# EAGLE design magicmouth-v1.0 (EAGLE 6.3)
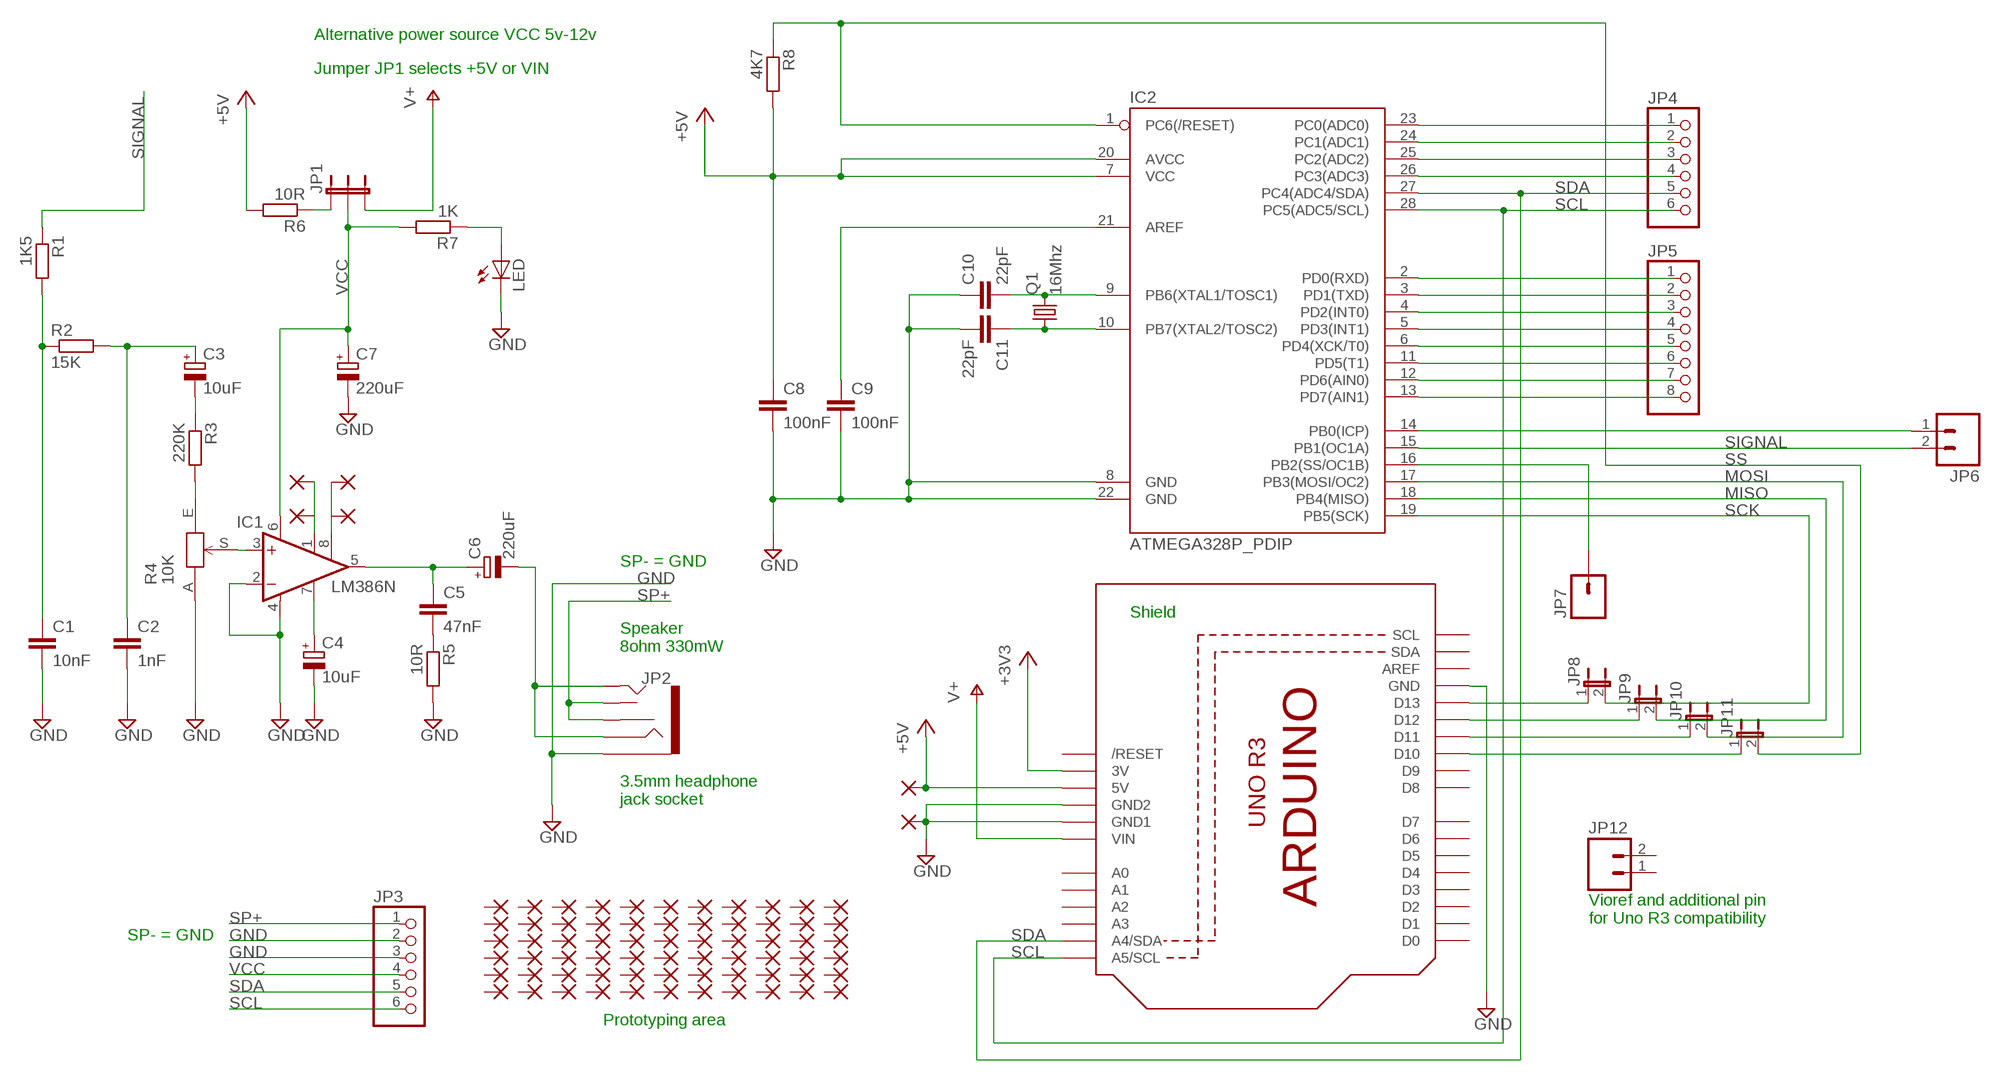
[diagram p0: schematic, sheet 1]

## Parts
C1  10nF  C-EU050-025X075  [C050-025X075]
C2  1nF  C-EU050-025X075  [C050-025X075]
C3  10uF  CPOL-EUE2.5-7  [E2,5-7]
C4  10uF  CPOL-EUE2.5-7  [E2,5-7]
C5  47nF  C-EU050-025X075  [C050-025X075]
C6  220uF  CPOL-EUTT2D7  [TT2D7]
C7  220uF  CPOL-EUTT2D7  [TT2D7]
C8  100nF  C-EU025-025X050  [C025-025X050]
C9  100nF  C-EU025-025X050  [C025-025X050]
C10  22pF  C-EU025-025X050  [C025-025X050]
C11  22pF  C-EU025-025X050  [C025-025X050]
IC1  LM386N  LM386N-1  [DIL08]
IC2  ATMEGA328P_PDIP  [DIL28-3]
JP1  JUMPER-3PTH  [1X03]
JP2  AUDIO-JACK2PTH  [AUDIO-JACK]
JP3  PINHD-1X6CB  [1X06-CLEANBIG]
JP4  PINHD-1X6CB  [1X06-CLEANBIG]
JP5  PINHD-1X8CLEANBIG  [1X08-CLEANBIG]
JP6  M021X02_NO_SILK  [1X02_NO_SILK]
JP7  M01SMDNS  [1X01NS]
JP8  JUMPER-2PTH  [1X02]
JP9  JUMPER-2PTH  [1X02]
JP10  JUMPER-2PTH  [1X02]
JP11  JUMPER-2PTH  [1X02]
JP12  M021X02_NO_SILK  [1X02_NO_SILK]
LED  LED3MM  [LED3MM]
PAD1  1,6/0,8  [1,6/0,8]
PAD2  1,6/0,8  [1,6/0,8]
PAD3  1,6/0,8  [1,6/0,8]
PAD4  1,6/0,8  [1,6/0,8]
PAD7  1,6/0,8  [1,6/0,8]
PAD8  1,6/0,8  [1,6/0,8]
PAD9  1,6/0,8  [1,6/0,8]
PAD10  1,6/0,8  [1,6/0,8]
PAD11  1,6/0,8  [1,6/0,8]
PAD12  1,6/0,8  [1,6/0,8]
PAD13  1,6/0,8  [1,6/0,8]
PAD14  1,6/0,8  [1,6/0,8]
PAD15  1,6/0,8  [1,6/0,8]
PAD16  1,6/0,8  [1,6/0,8]
PAD17  1,6/0,8  [1,6/0,8]
PAD18  1,6/0,8  [1,6/0,8]
PAD19  1,6/0,8  [1,6/0,8]
PAD20  1,6/0,8  [1,6/0,8]
PAD21  1,6/0,8  [1,6/0,8]
PAD22  1,6/0,8  [1,6/0,8]
PAD23  1,6/0,8  [1,6/0,8]
PAD24  1,6/0,8  [1,6/0,8]
PAD25  1,6/0,8  [1,6/0,8]
PAD26  1,6/0,8  [1,6/0,8]
PAD27  1,6/0,8  [1,6/0,8]
PAD28  1,6/0,8  [1,6/0,8]
PAD29  1,6/0,8  [1,6/0,8]
PAD30  1,6/0,8  [1,6/0,8]
PAD31  1,6/0,8  [1,6/0,8]
PAD32  1,6/0,8  [1,6/0,8]
PAD33  1,6/0,8  [1,6/0,8]
PAD34  1,6/0,8  [1,6/0,8]
PAD35  1,6/0,8  [1,6/0,8]
PAD36  1,6/0,8  [1,6/0,8]
PAD37  1,6/0,8  [1,6/0,8]
PAD38  1,6/0,8  [1,6/0,8]
PAD39  1,6/0,8  [1,6/0,8]
PAD40  1,6/0,8  [1,6/0,8]
PAD41  1,6/0,8  [1,6/0,8]
PAD42  1,6/0,8  [1,6/0,8]
PAD43  1,6/0,8  [1,6/0,8]
PAD44  1,6/0,8  [1,6/0,8]
PAD45  1,6/0,8  [1,6/0,8]
PAD46  1,6/0,8  [1,6/0,8]
PAD47  1,6/0,8  [1,6/0,8]
PAD48  1,6/0,8  [1,6/0,8]
PAD49  1,6/0,8  [1,6/0,8]
PAD50  1,6/0,8  [1,6/0,8]
PAD51  1,6/0,8  [1,6/0,8]
PAD52  1,6/0,8  [1,6/0,8]
PAD53  1,6/0,8  [1,6/0,8]
PAD54  1,6/0,8  [1,6/0,8]
PAD55  1,6/0,8  [1,6/0,8]
PAD56  1,6/0,8  [1,6/0,8]
PAD57  1,6/0,8  [1,6/0,8]
PAD58  1,6/0,8  [1,6/0,8]
PAD59  1,6/0,8  [1,6/0,8]
PAD60  1,6/0,8  [1,6/0,8]
PAD61  1,6/0,8  [1,6/0,8]
PAD62  1,6/0,8  [1,6/0,8]
PAD63  1,6/0,8  [1,6/0,8]
PAD64  1,6/0,8  [1,6/0,8]
PAD65  1,6/0,8  [1,6/0,8]
PAD66  1,6/0,8  [1,6/0,8]
PAD67  1,6/0,8  [1,6/0,8]
PAD68  1,6/0,8  [1,6/0,8]
PAD69  1,6/0,8  [1,6/0,8]
PAD70  1,6/0,8  [1,6/0,8]
PAD71  1,6/0,8  [1,6/0,8]
PAD72  1,6/0,8  [1,6/0,8]
PAD73  1,6/0,8  [1,6/0,8]
PAD74  1,6/0,8  [1,6/0,8]
Q1  16Mhz  CRYSTALHC49S  [HC49/S]
R1  1K5  R-EU_0207/7  [0207/7]
R2  15K  R-EU_0207/7  [0207/7]
R3  220K  R-EU_0207/7  [0207/7]
R4  10K  TPOT3352  [3352T]
R5  10R  R-EU_0207/7  [0207/7]
R6  10R  R-EU_0207/7  [0207/7]
R7  1K  R-EU_0207/7  [0207/7]
R8  4K7  R-EU_0207/7  [0207/7]
U1  ARDUINOR3-NOIOREF-NOTEXT  [ARDUINOR3-NOTEXT-NOIOREF]

## Nets
+3V3: U1.3V
+5V: C8.1 IC2.7(VCC) IC2.20(AVCC) PAD55.1(P) R6.2 R8.2 U1.5V
D8: IC2.14(PB0(ICP)) JP6.1
GND: C1.2 C2.2 C4.- C7.- C8.2 C9.2 C10.1 C11.2 IC1.2(-IN) IC1.4(GND) IC2.8(GND) IC2.22(GND) JP2.SLEEVE JP3.2 JP3.3 LED.K(C) PAD68.1(P) R4.A R5.2 U1.GND U1.GND1 U1.GND2
MISO: IC2.18(PB4(MISO)) JP9.2
MOSI: IC2.17(PB3(MOSI/OC2)) JP10.2
N$1: C5.1 C6.+ IC1.5(OUT)
N$2: C1.1 R1.2 R2.1
N$3: C9.1 IC2.21(AREF)
N$4: C5.2 R5.1
N$5: R3.2 R4.E
N$6: C10.2 IC2.9(PB6(XTAL1/TOSC1)) Q1.2
N$7: JP1.1 R6.1
N$8: C6.- JP2.RING JP2.TIP
N$9: IC1.3(+IN) R4.S
N$10: LED.A R7.1
N$11: C11.1 IC2.10(PB7(XTAL2/TOSC2)) Q1.1
N$12: IC2.16(PB2(SS/OC1B)) JP7.1
N$13: IC2.23(PC0(ADC0)) JP4.1
N$14: C2.1 C3.+ R2.2
N$15: IC2.24(PC1(ADC1)) JP4.2
N$16: IC2.2(PD0(RXD)) JP5.1
N$17: IC2.3(PD1(TXD)) JP5.2
N$18: IC2.4(PD2(INT0)) JP5.3
N$19: IC2.5(PD3(INT1)) JP5.4
N$20: IC2.6(PD4(XCK/T0)) JP5.5
N$21: IC2.11(PD5(T1)) JP5.6
N$22: IC2.12(PD6(AIN0)) JP5.7
N$23: IC2.13(PD7(AIN1)) JP5.8
N$24: C4.+ IC1.7(BYPASS)
N$32: IC2.25(PC2(ADC2)) JP4.3
N$33: IC2.26(PC3(ADC3)) JP4.4
N$58: IC1.1(GAIN) PAD1.1(P) PAD2.1(P)
N$87: C3.- R3.1
N$90: JP8.1 U1.D13
N$91: JP9.1 U1.D12
N$92: JP10.1 U1.D11
N$93: JP11.1 U1.D10
N$101: IC1.8(GAIN) PAD3.1(P) PAD4.1(P)
SCK: IC2.19(PB5(SCK)) JP8.2
SCL: IC2.28(PC5(ADC5/SCL)) JP3.6 JP4.6 U1.A5(A5/SCL)
SDA: IC2.27(PC4(ADC4/SDA)) JP3.5 JP4.5 U1.A4(A4/SDA)
SIGNAL: IC2.15(PB1(OC1A)) JP6.2 R1.1
SP+: JP2.RSH JP2.TSH JP3.1
SS: IC2.1(PC6(/RESET)) JP11.2 R8.1
VCC: C7.+ IC1.6(VS) JP1.2 JP3.4 R7.2
VIN: JP1.3 U1.VIN ; supply symbol labelled V+
Unconnected: JP12.1 JP12.2 PAD7.1(P) PAD8.1(P) PAD9.1(P) PAD10.1(P) PAD11.1(P) PAD12.1(P) PAD13.1(P) PAD14.1(P) PAD15.1(P) PAD16.1(P) PAD17.1(P) PAD18.1(P) PAD19.1(P) PAD20.1(P) PAD21.1(P) PAD22.1(P) PAD23.1(P) PAD24.1(P) PAD25.1(P) PAD26.1(P) PAD27.1(P) PAD28.1(P) PAD29.1(P) PAD30.1(P) PAD31.1(P) PAD32.1(P) PAD33.1(P) PAD34.1(P) PAD35.1(P) PAD36.1(P) PAD37.1(P) PAD38.1(P) PAD39.1(P) PAD40.1(P) PAD41.1(P) PAD42.1(P) PAD43.1(P) PAD44.1(P) PAD45.1(P) PAD46.1(P) PAD47.1(P) PAD48.1(P) PAD49.1(P) PAD50.1(P) PAD51.1(P) PAD52.1(P) PAD53.1(P) PAD54.1(P) PAD56.1(P) PAD57.1(P) PAD58.1(P) PAD59.1(P) PAD60.1(P) PAD61.1(P) PAD62.1(P) PAD63.1(P) PAD64.1(P) PAD65.1(P) PAD66.1(P) PAD67.1(P) PAD69.1(P) PAD70.1(P) PAD71.1(P) PAD72.1(P) PAD73.1(P) PAD74.1(P) U1.A0 U1.A1 U1.A2 U1.A3 U1.AREF U1.D0 U1.D1 U1.D2 U1.D3 U1.D4 U1.D5 U1.D6 U1.D7 U1.D8 U1.D9 U1.RESET(/RESET) U1.SCL U1.SDA

## Notes on the sheet
- Alternative power source VCC 5v-12v
- Jumper JP1 selects +5V or VIN
- SP- = GND
- Shield
- Speaker
  8ohm 330mW
- 3.5mm headphone
  jack socket
- Vioref and additional pin
  for Uno R3 compatibility
- SP- = GND
- Prototyping area

## Library data of the parts
C1 C2 C5 = rcl:C-EU: CAPACITOR, European symbol
C3 C4 C6 C7 = rcl:CPOL-EU: POLARIZED CAPACITOR, European symbol
C8 = rcl:C-EU: CAPACITOR, European symbol; CAPACITANCE: 10 nF
C9 = rcl:C-EU: CAPACITOR, European symbol; CAPACITANCE: 100 nF
C10 C11 = rcl:C-EU: CAPACITOR, European symbol; CAPACITANCE: 22 pf
IC1 = linear:LM386?-*: Low Voltage Audio Power Amplifier Source: http://cache.national.com/ds/LM/LM386.pdf
IC2 = SparkFun-DigitalIC:ATMEGA328P_PDIP: uC used in the Arduino 32kb flash, 1k EEPROM, 2k SRAM This is the through-hole version of this chip.
JP1 = SparkFun-Passives:JUMPER-3
JP2 = SparkFun-Connectors:AUDIO-JACK2: Stereo audio jack with bypass switches.
JP3 JP4 = adafruit:PINHD-1X6: PIN HEADER
JP5 = adafruit:PINHD-1X8: PIN HEADER
JP6 = SparkFun-Connectors:M02: Header 2 Standard 2-pin 0.1" header. Use with straight break away headers (SKU : PRT-00116), right angle break away headers (PRT-00553), swiss pins (PRT-00743), machine pins (PRT-00117), and female headers (PRT-00115). Molex polarized connector foot print use with SKU : PRT-08233 with associated crimp pins and housings.
JP7 = SparkFun-Connectors:M01: Header 1 Standard 1-pin 0.1" header. Use with straight break away headers (SKU : PRT-00116), right angle break away headers (PRT-00553), swiss pins (PRT-00743), machine pins (PRT-00117), and female headers (PRT-00115).
JP8-JP11 = SparkFun-Passives:JUMPER-2: Jumper Basic 0.1" spaced jumper. Use with breakaway headers.
JP12 = SparkFun:M02: Header 2 Standard 2-pin 0.1" header. Use with straight break away headers (SKU : PRT-00116), right angle break away headers (PRT-00553), swiss pins (PRT-00743), machine pins (PRT-00117), and female headers (PRT-00115). Molex polarized connector foot print use with SKU : PRT-08233 with associated crimp pins and housings.
LED = led:LED: LED OSRAM: - CHIPLED LG R971, LG N971, LY N971, LG Q971, LY Q971, LO R971, LY R971 LH N974, LH R974 LS Q976, LO Q976, LY Q976 LO Q996 - Hyper CHIPLED LW Q18S LB Q993, LB Q99A, LB R99A - SideLED LS A670, LO A670, LY A670, LG A670, LP A670 LB A673, LV A673, LT A673, LW A673 LH A674 LY A675 LS A676, LA A676, LO A676, LY A676, LW A676 LS A679, LY A679, LG A679 - Hyper Micro SIDELED® LS Y876, LA Y876, LO Y876, LY Y876 LT Y87S - SmartLED LW L88C, LW L88S LB L89C, LB L89S, LG L890 LS L89K, LO L89K, LY L89K LS L896, LA L896, LO L896, LY L896 - TOPLED LS T670, LO T670, LY T670, LG T670, LP T670 LSG T670, LSP T670, LSY T670, LOP T670, LYG T670 LG T671, LOG T671, LSG T671 LB T673, LV T673, LT T673, LW T673 LH T674 LS T676, LA T676, LO T676, LY T676, LB T676, LH T676, LSB T676, LW T676 LB T67C, LV T67C, LT T67C, LS T67K, LO T67K, LY T67K, LW E67C LS E67B, LA E67B, LO E67B, LY E67B, LB E67C, LV E67C, LT E67C LW T67C LS T679, LY T679, LG T679 LS T770, LO T770, LY T770, LG T770, LP T770 LB T773, LV T773, LT T773, LW T773 LH T774 LS E675, LA E675, LY E675, LS T675 LS T776, LA T776, LO T776, LY T776, LB T776 LHGB T686 LT T68C, LB T68C - Hyper Mini TOPLED® LB M676 - Mini TOPLED Santana® LG M470 LS M47K, LO M47K, LY M47K Source: http://www.osram.convergy.de - LUMILED® LXK2-PW12-R00, LXK2-PW12-S00, LXK2-PW14-U00, LXK2-PW14-V00 LXK2-PM12-R00, LXK2-PM12-S00, LXK2-PM14-U00 LXK2-PE12-Q00, LXK2-PE12-R00, LXK2-PE12-S00, LXK2-PE14-T00, LXK2-PE14-U00 LXK2-PB12-K00, LXK2-PB12-L00, LXK2-PB12-M00, LXK2-PB14-N00, LXK2-PB14-P00, LXK2-PB14-Q00 LXK2-PR12-L00, LXK2-PR12-M00, LXK2-PR14-Q00, LXK2-PR14-R00 LXK2-PD12-Q00, LXK2-PD12-R00, LXK2-PD12-S00 LXK2-PH12-R00, LXK2-PH12-S00 LXK2-PL12-P00, LXK2-PL12-Q00, LXK2-PL12-R00 Source: www.luxeon.com
PAD1-PAD4 PAD7-PAD74 = wirepad:1,6/0,8: THROUGH-HOLE PAD
Q1 = crystal:CRYSTAL: CRYSTAL; OC_FARNELL: 1667008; OC_NEWARK: unknown
R1 R2 R6 R7 = rcl:R-EU_: RESISTOR, European symbol
R3 R5 = resistor:R-EU_: RESISTOR, European symbol
R4 = t0mpr1c3:TPOT: Bourns thumbwheel trimmer resistor
R8 = rcl:R-EU_: RESISTOR, European symbol; RESISTANCE: 4K7
U1 = adafruit:ARDUINOR3-NOIOREF

## Board
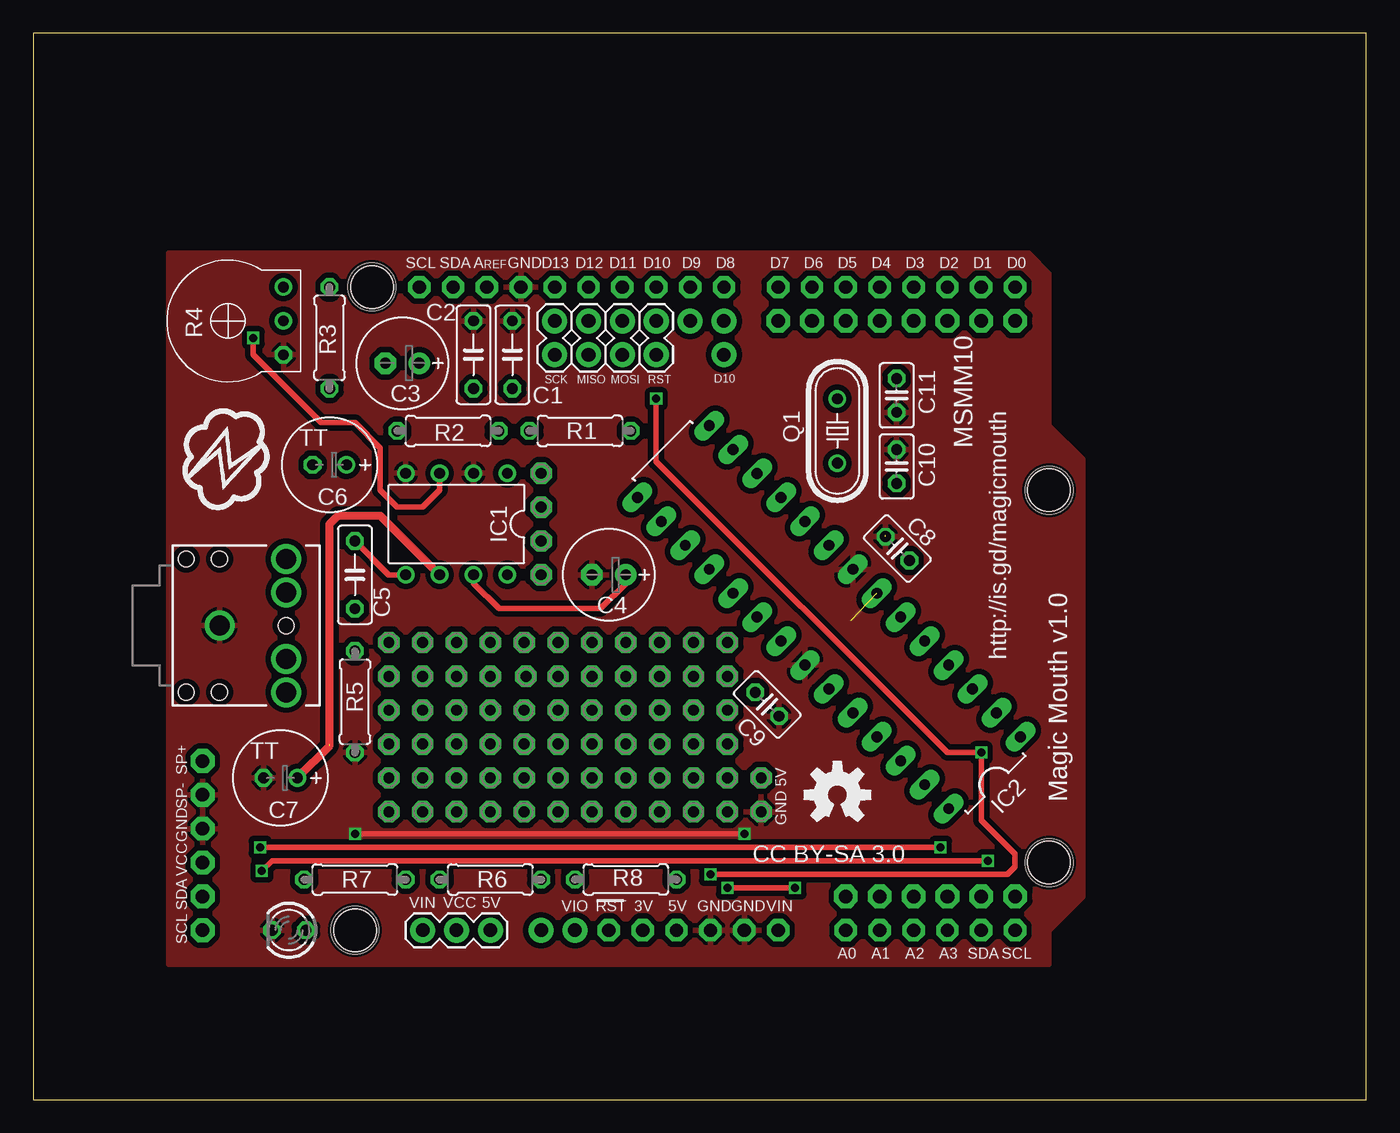
[diagram p1: board, top side]
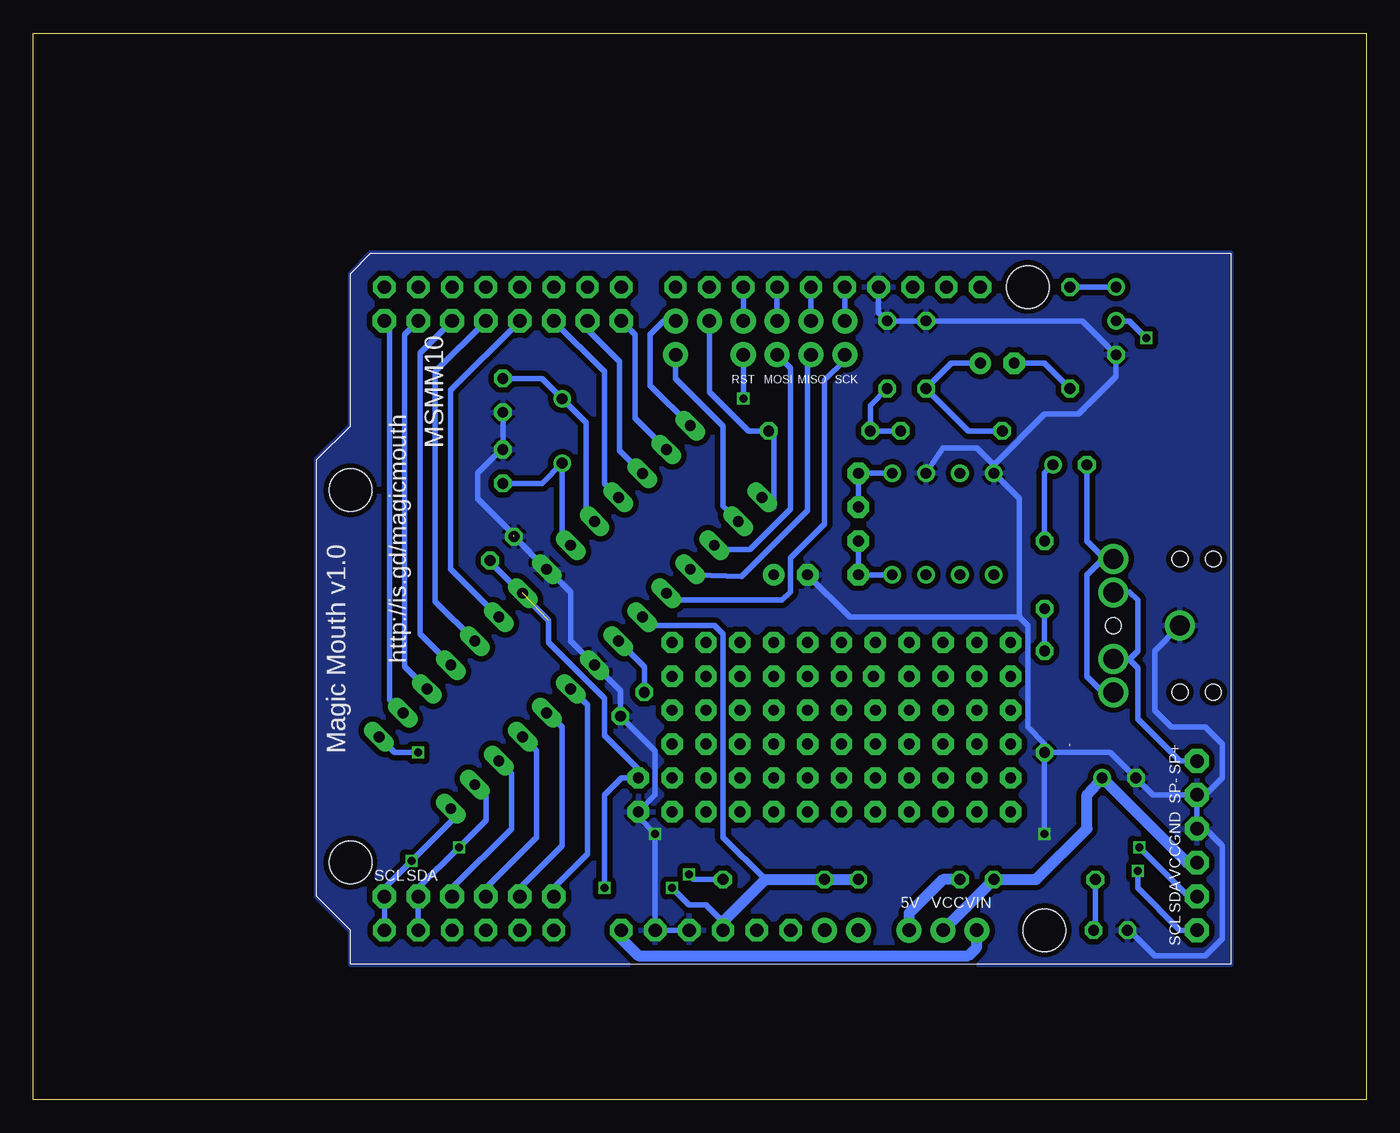
[diagram p2: board, bottom side, seen from below]

Size 100 x 80 mm. Coordinates in mm from the lower left corner, seen from the top.
Outline: 0,0 100,0 100,80 0,80 0,0
Copper layers (1*16): Top 0.035mm / dielectric 1.5mm / Bottom 0.035mm
Design rules "Fusion_eagle_rule_v1.1": minimum track width 6mil, minimum drill 12mil, track to track 6mil, track to pad 6mil, pad to pad 6mil, via to via 6mil, smd to smd 0mil, copper to edge 10mil, drill to drill 10mil, minimum pad ring 10mil, minimum via ring 6mil, stop-mask expansion 2mil, vias tented up to drill 100mil, thermal gap 10mil
Holes 3.2 mm at 76.2,45.72 76.2,17.78 24.13,12.7 25.4,60.96

### Footprints (pad centres in the part's own frame; a part is rotated, then mirrored left to right if it is on the bottom)
C050-025X075 = drill 0.813 octagon: 1 -2.54,0; 2 2.54,0
E2,5-7 = drill 0.813 pad 1.6: + -1.27,0 | drill 0.813 pad 1.6 octagon: - 1.27,0
TT2D7 = drill 0.813: + -1.27,0 | drill 0.813 octagon: - 1.27,0
C025-025X050 = drill 0.813 octagon: 1 -1.27,0; 2 1.27,0
DIL08 = drill 0.813 pad 1.27: 1 -3.81,-3.81; 2 -1.27,-3.81; 3 1.27,-3.81; 4 3.81,-3.81; 5 3.81,3.81; 6 1.27,3.81; 7 -1.27,3.81; 8 -3.81,3.81
DIL28-3 = drill 0.813 long: 1 -16.51,-3.81; 2 -13.97,-3.81; 3 -11.43,-3.81; 4 -8.89,-3.81; 5 -6.35,-3.81; 6 -3.81,-3.81; 7 -1.27,-3.81; 8 1.27,-3.81; 9 3.81,-3.81; 10 6.35,-3.81; 11 8.89,-3.81; 12 11.43,-3.81; 13 13.97,-3.81; 14 16.51,-3.81; 15 16.51,3.81; 16 13.97,3.81; 17 11.43,3.81; 18 8.89,3.81; 19 6.35,3.81; 20 3.81,3.81; 21 1.27,3.81; 22 -1.27,3.81; 23 -3.81,3.81; 24 -6.35,3.81; 25 -8.89,3.81; 26 -11.43,3.81; 27 -13.97,3.81; 28 -16.51,3.81
1X03 = drill 1.016 pad 1.88: 1 0,0; 2 2.54,0; 3 5.08,0
AUDIO-JACK = drill 1.5 pad 2.184: RING 5,5; RSH 5,2.5; SLEEVE 0,0; TIP 5,-5; TSH 5,-2.5 | hole 1.2: 0,5; -2.5,5; -2.5,-5; 0,-5; 5,0
1X06-CLEANBIG = drill 1.016 pad 1.778 octagon: 1 -6.35,0; 2 -3.81,0; 3 -1.27,0; 4 1.27,0; 5 3.81,0; 6 6.35,0
1X08-CLEANBIG = drill 1.016 pad 1.778 octagon: 1 -8.89,0; 2 -6.35,0; 3 -3.81,0; 4 -1.27,0; 5 1.27,0; 6 3.81,0; 7 6.35,0; 8 8.89,0
1X02_NO_SILK = drill 1.016 pad 1.88: 1 0,0; 2 2.54,0
1X01NS = drill 1.016 pad 1.88: 1 0,0
1X02 = drill 1.016 pad 1.88: 1 0,0; 2 2.54,0
LED3MM = drill 0.813 octagon: A -1.27,0; K 1.27,0
1,6/0,8 = drill 0.813 pad 1.6 octagon: 1 0,0
HC49/S = drill 0.813: 1 -2.413,0; 2 2.413,0
0207/7 = drill 0.813 octagon: 1 -3.81,0; 2 3.81,0
3352T = drill 0.8 pad 1.27 octagon: A -2.54,-4.16 | drill 0.8 pad 1.27: E 2.54,-4.16; S 0,-4.16
ARDUINOR3-NOTEXT-NOIOREF = drill 1 pad 1.676 octagon: 3V 35.56,2.54; 5V 38.1,2.54; A0 50.8,2.54; A1 53.34,2.54; A2 55.88,2.54; A3 58.42,2.54; A4 60.96,2.54; A5 63.5,2.54; AREF 23.876,50.8; D0 63.5,50.8; D1 60.96,50.8; D2 58.42,50.8; D3 55.88,50.8; D4 53.34,50.8; D5 50.8,50.8; D6 48.26,50.8; D7 45.72,50.8; D8 41.656,50.8; D9 39.116,50.8; D10 36.576,50.8; D11 34.036,50.8; D12 31.496,50.8; D13 28.956,50.8; GND 26.416,50.8; GND1 43.18,2.54; GND2 40.64,2.54; RESET 33.02,2.54; SCL 18.796,50.8; SDA 21.336,50.8; VIN 45.72,2.54

### Placement (x,y rotation side)
C1  35.94,55.88 90 top
C2  33.02,55.88 90 top
C3  27.69,55.24 180 top
C4  43.18,39.37 180 top
C5  24.13,39.37 270 top
C6  22.23,47.62 180 top
C7  18.54,24.13 180 top
C8  64.83,41.34 135 top
C9  55.05,29.65 315 top
C10  64.77,47.5 270 top
C11  64.77,52.83 270 top
IC1  31.75,43.18 180 top
IC2  59.69,36.2 135 top
JP1  34.29,12.7 180 top
JP2  13.97,35.56 0 top
JP3  12.7,19.05 270 top
JP4  67.31,15.24 0 top
JP5  64.77,58.42 180 top
JP6  51.82,58.42 180 top
JP7  51.82,55.88 180 top
JP8  39.12,58.42 270 top
JP9  41.66,58.42 270 top
JP10  44.2,58.42 270 top
JP11  46.74,58.42 270 top
JP12  38.1,12.7 0 top
LED  19.18,12.7 180 top
PAD1  38.1,46.99 0 top
PAD2  38.1,44.45 0 top
PAD3  38.1,39.37 0 top
PAD4  38.1,41.91 0 top
PAD7  26.67,21.59 0 top
PAD8  29.21,21.59 0 top
PAD9  49.53,34.29 0 top
PAD10  52.07,34.29 0 top
PAD11  52.07,31.75 0 top
PAD12  49.53,31.75 0 top
PAD13  49.53,29.21 0 top
PAD14  49.53,26.67 0 top
PAD15  49.53,24.13 0 top
PAD16  49.53,21.59 0 top
PAD17  52.07,29.21 0 top
PAD18  52.07,21.59 0 top
PAD19  52.07,24.13 0 top
PAD20  52.07,26.67 0 top
PAD21  31.75,21.59 0 top
PAD22  34.29,21.59 0 top
PAD23  36.83,21.59 0 top
PAD24  39.37,21.59 0 top
PAD25  41.91,21.59 0 top
PAD26  46.99,21.59 0 top
PAD27  46.99,31.75 0 top
PAD28  26.67,26.67 0 top
PAD29  46.99,24.13 90 top
PAD30  46.99,34.29 90 top
PAD31  29.21,24.13 90 top
PAD32  29.21,26.67 90 top
PAD33  34.29,26.67 90 top
PAD34  31.75,24.13 90 top
PAD35  31.75,26.67 90 top
PAD36  36.83,26.67 90 top
PAD37  34.29,24.13 90 top
PAD38  39.37,24.13 90 top
PAD39  39.37,26.67 90 top
PAD40  26.67,24.13 90 top
PAD41  46.99,26.67 90 top
PAD42  41.91,26.67 90 top
PAD43  36.83,24.13 90 top
PAD44  44.45,24.13 90 top
PAD45  46.99,29.21 90 top
PAD46  44.45,21.59 90 top
PAD47  41.91,24.13 90 top
PAD48  44.45,26.67 90 top
PAD49  41.91,34.29 90 top
PAD50  44.45,34.29 90 top
PAD51  29.21,31.75 90 top
PAD52  44.45,31.75 90 top
PAD53  44.45,29.21 90 top
PAD54  29.21,29.21 90 top
PAD55  54.61,24.13 0 top
PAD56  39.37,34.29 90 top
PAD57  26.67,29.21 90 top
PAD58  26.67,34.29 90 top
PAD59  26.67,31.75 90 top
PAD60  31.75,31.75 90 top
PAD61  29.21,34.29 90 top
PAD62  31.75,34.29 90 top
PAD63  34.29,29.21 90 top
PAD64  34.29,34.29 90 top
PAD65  34.29,31.75 90 top
PAD66  31.75,29.21 90 top
PAD67  36.83,34.29 90 top
PAD68  54.61,21.59 0 top
PAD69  36.83,29.21 90 top
PAD70  39.37,29.21 90 top
PAD71  41.91,29.21 90 top
PAD72  36.96,31.75 90 top
PAD73  39.37,31.75 90 top
PAD74  41.91,31.75 90 top
Q1  60.33,50.16 270 top
R1  41.02,50.16 180 top
R2  31.11,50.16 180 top
R3  22.23,57.15 90 top
R4  14.61,58.42 90 top
R5  24.13,29.84 270 top
R6  34.29,16.51 0 top
R7  24.13,16.51 0 top
R8  44.45,16.51 180 top
U1  10.16,10.16 0 top
U$1  [OSHW-LOGO-M]  60.33,22.86 0 top

### Tracks (layer width: path | path; a pad name or v marks a point on that pad's centre or on a via)
+5V  (via drill 0.6)  (1 unrouted)
  Top 0.406: v57.15,15.88 v52.07,15.88
  Bottom 0.406: C8.1 65.73,40.33 61.34,35.94 61.34,34.29 57.15,30.1 57.15,27.3 54.61,24.77 PAD55.1 55.88,24.13 57.15,22.86 v57.15,15.88 | 45.09,16.51 48.26,19.68 48.26,34.92 48.9,35.56 53.67,35.56 IC2.20 | v52.07,15.88 50.8,14.61 49.53,14.61 48.26,13.34
  Bottom 0.813: U1.5V 48.26,13.34 45.09,16.51 R8.2 R6.2
D8
  Bottom 0.406: JP6.1 52.7,58.42 53.72,57.4 53.72,53.58 IC2.14
GND  (via drill 0.6)  (1 unrouted)
  Top 0.406: v53.34,19.94 v24.13,19.94
  Bottom 0.406: JP3.2 12.06,22.86 10.79,24.13 10.79,26.67 12.06,27.94 14.61,27.94 15.88,29.21 15.88,33.66 JP2.SLEEVE | JP3.2 JP3.3 12.06,20.32 10.79,19.05 10.79,12.06 12.06,10.79 15.88,10.79 17.78,12.7 LED.K | v24.13,19.94 R5.2 | U1.GND 36.58,59.05 C1.2 C2.2 21.3,58.42 R4.A 18.77,54.26 21.59,51.44 24.13,51.44 27.94,47.62 | R5.2 24.13,26.67 25.4,27.94 25.4,35.56 26.04,36.2 | C11.2 C10.1 64.9,48.77 66.67,46.99 66.67,45.09 63.94,42.34 | IC2.8 | IC2.8 C8.2 | IC2.8 61.38,39.79 59.69,38.1 59.69,34.4 IC2.22 55.95,30.66 C9.2 53.34,26.14 53.34,22.86 PAD68.1 54.61,21.21 v53.34,19.94 U1.GND1 U1.GND2 | 26.04,36.2 26.04,45.09 IC1.4 27.94,47.62 | IC1.2 31.75,48.9 29.21,48.9 27.94,47.62 | JP3.2 16,22.86 C7.- 19.18,26.04 R5.2 | C4.- 38.73,36.2 26.04,36.2
  pour Bottom (isolate 0.406): 76.2,12.7 78.74,15.24 78.74,48.01 76.2,50.55 76.2,61.98 74.68,63.5 10.16,63.5 10.16,10.16 76.2,10.16
  pour Top (isolate 0.406): 10.16,10.16 10.16,63.5 74.68,63.5 76.2,61.98 76.2,50.55 78.74,48.01 78.74,15.24 76.2,12.7 76.2,10.16
MISO
  Bottom 0.406: JP9.2 41.91,55.5 41.91,44.2 46.86,39.24 50.29,39.37 IC2.18
MOSI
  Bottom 0.406: JP10.2 43.18,54.86 43.18,44.32 46.23,41.27 48.61,41.27 IC2.17
N$1
  Top 0.406: C5.1 26.67,39.37 IC1.5
  Bottom 0.406: C5.1 24.13,46.99 C6.+
N$2
  Bottom 0.406: C1.1 37.21,52.07 R1.2 R2.1
N$3
  Bottom 0.406: C9.1 54.16,32.46 IC2.21
N$4
  Bottom 0.406: C5.2 R5.1
N$5
  Bottom 0.406: R4.E R3.2
N$6
  Bottom 0.406: C10.2 61.85,46.23 Q1.2 60.33,42.22 IC2.9
N$7
  Bottom 0.813: R6.1 31.75,16.51 34.29,13.97 JP1.1
N$8
  Bottom 0.406: JP2.TIP 19.05,30.48 19.68,30.48 20.95,31.75 20.95,39.37 19.68,40.64 | 19.68,40.64 19.05,40.64 JP2.RING | C6.- 20.95,41.91 19.68,40.64
N$9  (via drill 0.6)
  Top 0.406: v16.51,57.15 16.51,55.88 21.59,50.8 24.13,50.8 26.04,48.9 26.04,45.72 27.3,44.45 29.21,44.45 30.48,45.72 IC1.3
  Bottom 0.406: R4.S 17.78,58.42 v16.51,57.15
N$10
  Bottom 0.406: R7.1 20.32,13.34 20.45,13.21 LED.A
N$11
  Bottom 0.406: C11.1 61.85,54.1 Q1.1 58.55,50.8 58.55,44.03 IC2.10
N$12
  Bottom 0.406: JP7.1 51.82,54.1 48.26,50.55 48.26,44.52 IC2.16
N$13
  Bottom 0.406: JP4.1 60.96,15.88 58.42,18.41 58.42,29.59 59.64,30.81 IC2.23
N$14
  Bottom 0.406: R2.2 29.84,50.16 C2.1 31.11,55.24 C3.+
N$15
  Bottom 0.406: JP4.2 63.5,15.88 60.33,19.05 60.33,27.94 61.4,29.01 IC2.24
N$16
  Bottom 0.406: JP5.1 73.28,58.04 73.28,30.03 IC2.2
N$17
  Bottom 0.406: JP5.2 72.14,57.4 72.14,32.48 IC2.3
N$18
  Bottom 0.406: JP5.3 70.99,56.01 70.99,34.93 IC2.4
N$19
  Bottom 0.406: JP5.4 69.85,54.61 69.85,37.38 IC2.5
N$20
  Bottom 0.406: JP5.5 68.71,53.21 68.71,39.82 IC2.6
N$21
  Bottom 0.406: JP5.6 57.15,54.61 57.15,46.23 IC2.11
N$22
  Bottom 0.406: JP5.7 58.42,57.78 56.01,55.37 56.01,48.68 IC2.12
N$23
  Bottom 0.406: JP5.8 54.86,57.4 54.86,51.13 IC2.13
N$24
  Top 0.406: IC1.7 33.02,38.73 34.92,36.83 42.55,36.83 44.45,38.73 C4.+
N$32
  Bottom 0.406: JP4.3 66.04,15.88 62.23,19.68 62.23,26.16 IC2.25
N$33
  Bottom 0.406: JP4.4 68.58,15.88 64.14,20.32 64.14,24.48 IC2.26
N$58
  Bottom 0.406: PAD2.1 PAD1.1 IC1.1
N$87
  Bottom 0.406: C3.- 24.13,55.24 R3.1
N$90
  Bottom 0.406: U1.D13 JP8.1
N$91
  Bottom 0.406: U1.D12 JP9.1
N$92
  Bottom 0.406: U1.D11 JP10.1
N$93
  Bottom 0.406: U1.D10 JP11.1
N$101
  Bottom 0.406: IC1.8 PAD3.1 PAD4.1
SCK
  Bottom 0.406: JP8.2 39.12,55.5 40.64,53.98 40.64,43.18 43.18,40.64 43.18,38.1 43.81,37.47 51.98,37.47 IC2.19
SCL  (via drill 0.6)
  Top 0.406: v71.63,17.91 17.91,17.91 v17.14,17.14
  Bottom 0.406: 68.58,21.59 68.58,20.95 v71.63,17.91 73.66,15.88 JP4.6 U1.A5 | 68.58,21.59 68.58,21.74 | JP3.6 13.97,12.7 17.14,15.88 v17.14,17.14 | IC2.28 68.67,21.68 68.58,21.59
SDA  (via drill 0.6)
  Top 0.406: v17.02,18.92 v68.07,18.92
  Bottom 0.406: JP3.5 13.34,15.24 v17.02,18.92 | IC2.27 66.8,23.62 66.04,22.86 66.04,20.95 v68.07,18.92 71.12,15.88 JP4.5 U1.A4
SIGNAL
  Bottom 0.406: JP6.2 49.28,53.09 46.35,50.16 R1.1 44.45,49.78 44.45,44.45 44.6,44.45 IC2.15
SP+
  Bottom 0.406: 17.78,33.02 18.93,33.02 JP2.TSH 17.74,33.06 | JP2.RSH 18.93,38.1 17.78,38.1 17.14,37.47 17.14,33.66 17.78,33.02 | 13.34,25.4 JP3.1 13.97,25.4 17.14,28.57 17.14,32.38 17.78,33.02
SS  (via drill 0.6)
  Top 0.406: v46.74,52.58 46.74,47.88 68.58,26.04 v71.12,26.04 71.12,20.95 73.66,18.41 73.66,17.46 73.09,16.89 v50.8,16.89
  Bottom 0.406: JP11.2 v46.74,52.58 | v71.12,26.04 72.88,26.04 IC2.1 | R8.1 50.42,16.51 v50.8,16.89
VCC  (1 unrouted)
  Top 0.61: 22.23,26.67 22.23,43.18 22.86,43.81 26.04,43.81 IC1.6 | 22.23,26.54 C7.+
  Bottom 0.813: JP3.4 13.46,17.78 C7.+ 20.95,22.86 20.95,20.32 24.77,16.51 R7.2 JP1.2
VIN
  Bottom 0.813: U1.VIN 55.88,12.06 54.61,10.79 29.84,10.79 29.21,11.43 JP1.3

### Text on the board
tPlace: SCL | SDA | A | REF | GND | D13 | D12 | D11 | D10 | D9 | D8 | D7 | D6 | D5 | D4 | D3 | D2 | D1 | D0 | SCK | MISO | MOSI | RST | D10 | MSMM10 | http://is.gd/magicmouth | SP+ | 5V | SP- | Magic Mouth v1.0 | GND | GND | CC BY-SA 3.0 | VCC | _ | SDA | VIN | VCC | 5V | VIO | RST | 3V | 5V | GND | GND | VIN | SCL | A0 | A1 | A2 | A3 | SDA | SCL
bPlace: SCK | MISO | MOSI | RST | MSMM10 | Magic Mouth v1.0 | http://is.gd/magicmouth | SP+ | SP- | GND | VCC | SDA | SDA | SCL | SCL | VIN | VCC | 5V